# Altium project adapter-50-100mil-x12.PrjPcb
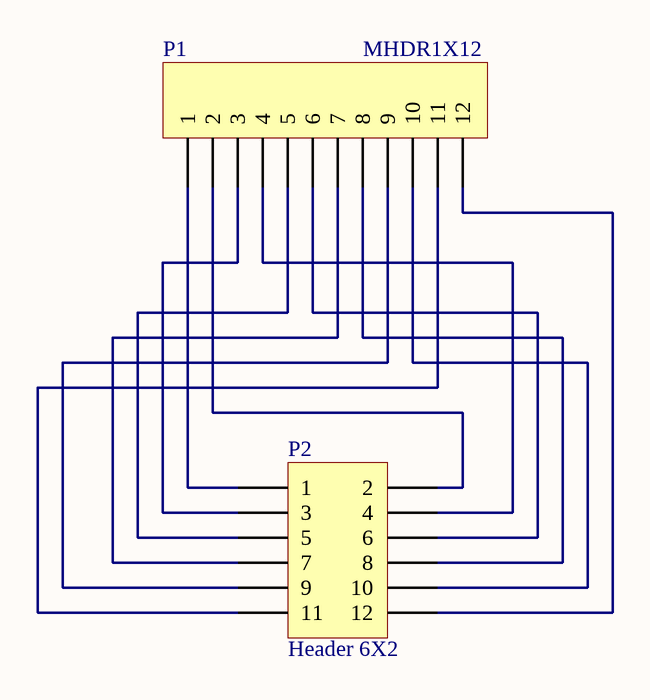
[diagram p0: adapter-50-100mil-x12.SchDoc]
1 sheet, 2 parts. Net scope: global (net labels, ports and power ports of the same name join across sheets).
Board file: adapter-50-100mil-x12.PcbDoc

## Sheet adapter-50-100mil-x12.SchDoc
size A

### Parts
P1  MHDR1X12  [MHDR1X12]
P2  Header 6X2  [HDR2X6]

### Nets
NetP1_1: P1.1 P2.1
NetP1_2: P1.2 P2.2
NetP1_3: P1.3 P2.3
NetP1_4: P1.4 P2.4
NetP1_5: P1.5 P2.5
NetP1_6: P1.6 P2.6
NetP1_7: P1.7 P2.7
NetP1_8: P1.8 P2.8
NetP1_9: P1.9 P2.9
NetP1_10: P1.10 P2.10
NetP1_11: P1.11 P2.11
NetP1_12: P1.12 P2.12

### Library data of the parts
P1 = MHDR1X12: Header, 12-Pin; LatestRevisionDate: 17-Jul-2002; LatestRevisionNote: Re-released for DXP Platform.; Publisher: Altium Limited
P2 = Header 6X2: Header, 6-Pin, Dual row; LatestRevisionDate: 17-Jul-2002; LatestRevisionNote: Re-released for DXP Platform.; Publisher: Altium Limited